# Altium project motorturn.PrjPCB
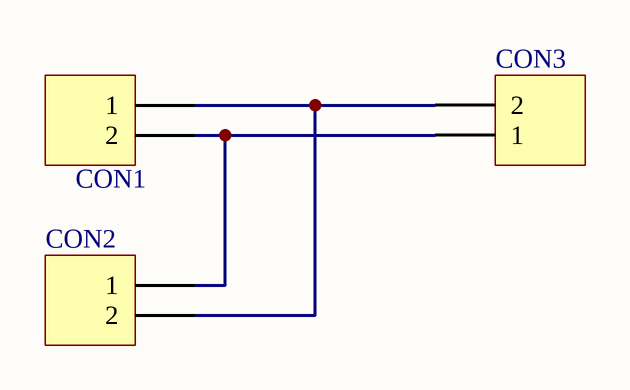
[diagram p0: motorturn.SchDoc]
1 sheet, 3 parts. Net scope: global (net labels, ports and power ports of the same name join across sheets).
Board file: motorturn.PcbDoc

## Sheet motorturn.SchDoc
size A4

### Parts
CON1  MHDR1X2  [CON]  (value not drawn)
CON2  MHDR1X2  [CON]  (value not drawn)
CON3  MHDR1X2  [CON]  (value not drawn)

### Nets
NetCON1_1: CON1.1 CON2.2 CON3.2
NetCON1_2: CON1.2 CON2.1 CON3.1

### Library data of the parts
CON1-CON3 = MHDR1X2: Header, 2-Pin; LatestRevisionDate: 17-Jul-2002; LatestRevisionNote: Re-released for DXP Platform.; Publisher: Altium Limited